# Altium project Power_Clock.PrjPcb
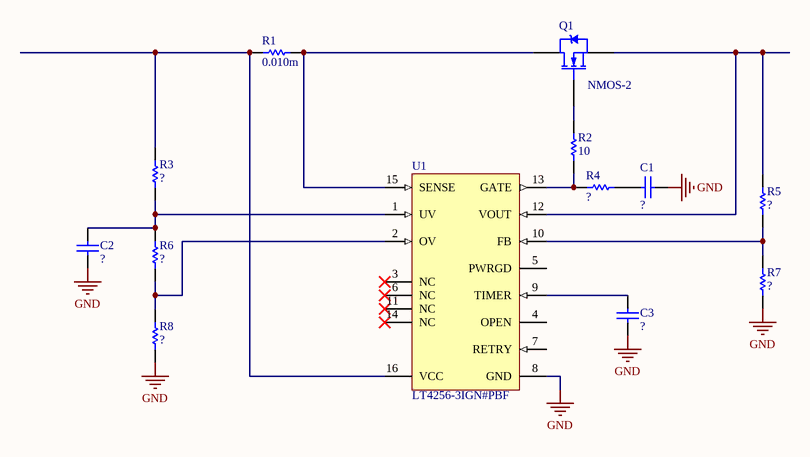
[diagram p0: Sheet1.SchDoc]
3 sheets, 55 parts. Net scope: strictly hierarchical (ports join the sheet entries above them; power ports are local).
Board file: PCB1.PcbDoc
Sheets:
  Sheet1.SchDoc
  Sheet2.SchDoc
  Sheet3.SchDoc

## Sheet Sheet1.SchDoc
size B; Author: E. Sims; Organization: Let's Build Rockets Inc.; SheetNumber: 1; SheetTotal: 3

### Parts
C1  Cap  [RAD-0.3]  (value not drawn)
C2  Cap  [RAD-0.3]  (value not drawn)
C3  Cap  [RAD-0.3]  (value not drawn)
Q1  NMOS-2  [TO-220AB]
R1  value 0.010m  [AXIAL-0.3]  (hidden comment: Res1)
R2  value 10  [AXIAL-0.3]  (hidden comment: Res1)
R3  Res1  [AXIAL-0.3]  (value not drawn)
R4  Res1  [AXIAL-0.3]  (value not drawn)
R5  Res1  [AXIAL-0.3]  (value not drawn)
R6  Res1  [AXIAL-0.3]  (value not drawn)
R7  Res1  [AXIAL-0.3]  (value not drawn)
R8  Res1  [AXIAL-0.3]  (value not drawn)
U1  LT4256-3IGN#PBF  [LT-GN-16_L]

### Nets
GND: C1.1 C2.1 C3.1 R7.1 R8.1 U1.8(GND)
NetC1_2: C1.2 R4.1
NetC2_2: C2.2 R3.1 R6.2 U1.1(UV)
NetC3_2: C3.2 U1.9(TIMER)
NetQ1_1: Q1.1(G) R2.2
NetQ1_2: Q1.2(D) R1.2 U1.15(SENSE)
NetQ1_3: Q1.3(S) R5.2 U1.12(VOUT)
NetR1_1: R1.1 R3.2 U1.16(VCC)
NetR2_1: R2.1 R4.2 U1.13(GATE)
NetR5_1: R5.1 R7.2 U1.10(FB)
NetR6_1: R6.1 R8.2 U1.2(OV)

Not connected (* = marked no-connect by the designer): U1 3(NC)* 4(OPEN) 5(PWRGD) 6(NC)* 7(RETRY) 11(NC)* 14(NC)*

### Notes on the sheet
- Let's Build Rocket's Inc. Modular Paylaod System Based on TMP-010 Rev
  For more information visit https://github.com/LetsBuildRockets/Modular-Payload-System
  This work is licensed under CC BY-NC 4.0. To view a copy of this license, visit https://creativecommons.org/licenses/by-nc/4.0
- Title
- Size:
- Date:
- Assembly Variant:
- B
- Number:
- Time:
- Revision:
- Sheet
- of
- Author:
- File:

### Library data of the parts
C1-C3 = Cap: Capacitor; Published: 8-Jun-2000; LatestRevisionDate: 17-Jul-2002; LatestRevisionNote: Re-released for DXP Platform.; PackageReference: RAD-0.3; Publisher: Altium Limited; PackageDescription: Radial Cap, Thru-Hole; 2 Leads; 0.3 in Pin Spacing; Value: ?
Q1 = NMOS-2: N-Channel Power MOSFET; Note: Pin 2 is electrically connected to pin 4.; Published: 8-Jun-2000; LatestRevisionDate: 17-Jul-2002; LatestRevisionNote: Re-released for DXP Platform.; DatasheetVersion: PD-9.814; PackageVersion: Feb-1997; PackageReference: TO-220AB; Publisher: Altium Limited; PackageDescription: TO, Thru-Hole, Vertical, Heatsink Mounted; 3 In-Line Leads; Pitch 2.54 mm; ComponentLink1Description: Manufacturer Link; ComponentLink1URL: http://www.irf.com/
R1-R8 = Res1: Resistor; Published: 8-Jun-2000; LatestRevisionDate: 17-Jul-2002; LatestRevisionNote: Re-released for DXP Platform.; PackageReference: AXIAL-0.3; Publisher: Altium Limited; PackageDescription: Axial Device, Thru-Hole; 2 Leads; 0.3 in Pin Spacing
  R3-R8: Value: ?
U1 = CMP-0474-00283-1: Positive High Voltage Hot Swap Controller with Open-Circuit Detect, 10.8 to 80 V Vin, 16-pin SOP (GN-16), -40 to 85 degC, Pb-Free; Manufacturer: Linear Technology; Circuit Breaker Threshold: 55 mV; In-Rush Current: Active; Circuit Breaker Accuracy(%): 18; Active Limiting: yes; Fast Comparator: no; Extended Temp: C, I; Circuit Breakers(#): 1; PackageDescription: 16-Pin Plastic SSOP, Body 4.9 x 3.9 mm, Pitch 0.635 mm; DatasheetVersion: Rev. A; PartNumber: LT4256-3IGN#PBF; RoHS: TRUE; PackageVersion: Rev. B, 03/2012; ComponentLink1URL: http://www.linear.com/; Reset: no; ComponentLink2URL: http://cds.linear.com/docs/en/datasheet/42563fa.pm6.pdf; ComponentLink3URL: http://cds.linear.com/docs/en/packaging/05081641_B_GN16.pdf; Fault: no; ComponentLink1Description: Manufacturer URL; Vin Range: 10.8 to 80 V; ComponentLink2Description: Datasheet; PackageReference: GN-16; Power Good: yes; ComponentLink3Description: Package Specification; Mounting Technology: Surface Mount; Foldback: yes

## Sheet Sheet2.SchDoc
size B; Author: E. Sims; Organization: Let's Build Rockets Inc.; SheetNumber: 2; SheetTotal: 3
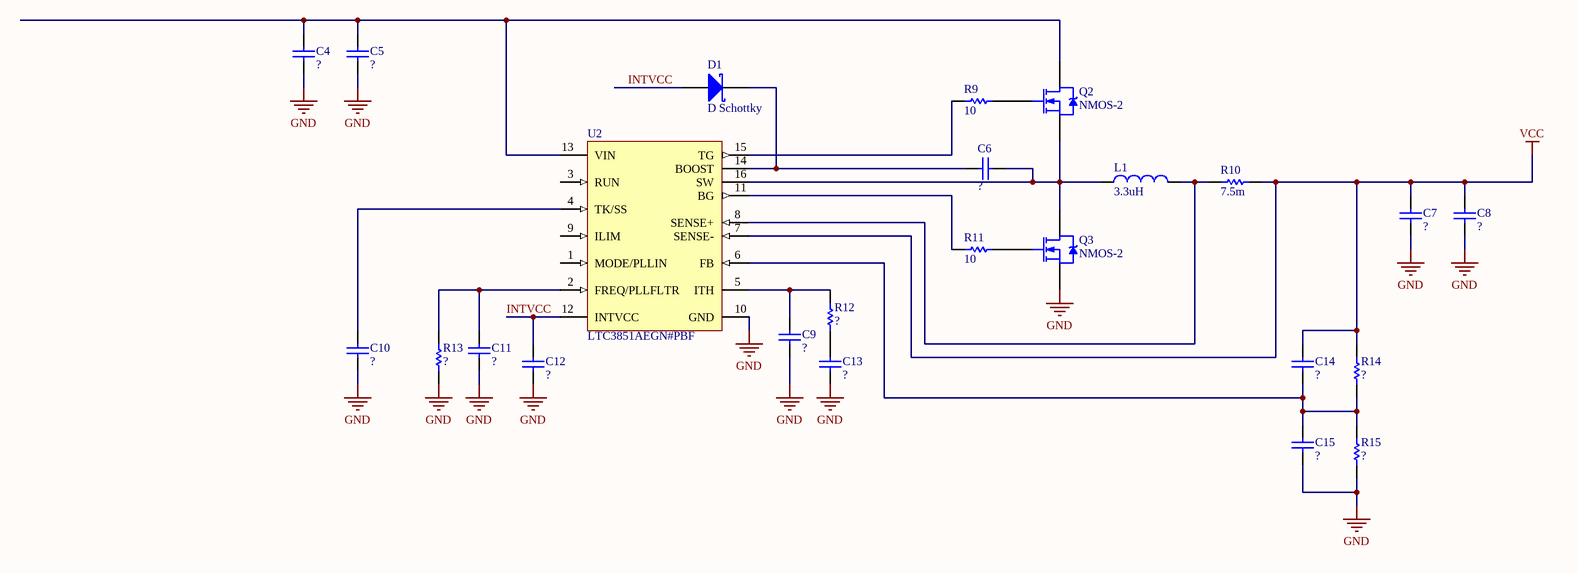
[diagram p1: Sheet2.SchDoc]

### Parts
C4  Cap  [RAD-0.3]  (value not drawn)
C5  Cap  [RAD-0.3]  (value not drawn)
C6  Cap  [RAD-0.3]  (value not drawn)
C7  Cap  [RAD-0.3]  (value not drawn)
C8  Cap  [RAD-0.3]  (value not drawn)
C9  Cap  [RAD-0.3]  (value not drawn)
C10  Cap  [RAD-0.3]  (value not drawn)
C11  Cap  [RAD-0.3]  (value not drawn)
C12  Cap  [RAD-0.3]  (value not drawn)
C13  Cap  [RAD-0.3]  (value not drawn)
C14  Cap  [RAD-0.3]  (value not drawn)
C15  Cap  [RAD-0.3]  (value not drawn)
D1  D Schottky  [SMB]
L1  value 3.3uH  [0402-A]  (hidden comment: Inductor)
Q2  NMOS-2  [TO-220AB]
Q3  NMOS-2  [TO-220AB]
R9  value 10  [AXIAL-0.3]  (hidden comment: Res1)
R10  value 7.5m  [AXIAL-0.3]  (hidden comment: Res1)
R11  value 10  [AXIAL-0.3]  (hidden comment: Res1)
R12  Res1  [AXIAL-0.3]  (value not drawn)
R13  Res1  [AXIAL-0.3]  (value not drawn)
R14  Res1  [AXIAL-0.3]  (value not drawn)
R15  Res1  [AXIAL-0.3]  (value not drawn)
U2  LTC3851AEGN#PBF  [LT-GN-16_L]

### Nets
GND: C4.1 C5.1 C7.1 C8.1 C9.1 C10.1 C11.1 C12.1 C13.1 C15.1 Q3.3(S) R13.1 R15.1 U2.10(GND)
VCC: C7.2 C8.2 C14.2 R10.1 R14.2 U2.7(SENSE-)
INTVCC: C12.2 D1.1(A) U2.12(INTVCC)
NetC4_2: C4.2 C5.2 Q2.2(D) U2.13(VIN)
NetC6_1: C6.1 L1.1 Q2.3(S) Q3.2(D) U2.16(SW)
NetC6_2: C6.2 D1.2(K) U2.14(BOOST)
NetC9_2: C9.2 R12.2 U2.5(ITH)
NetC10_2: C10.2 U2.4(TK/SS)
NetC11_2: C11.2 R13.2 U2.2(FREQ/PLLFLTR)
NetC13_2: C13.2 R12.1
NetC14_1: C14.1 C15.2 R14.1 R15.2 U2.6(FB)
NetL1_2: L1.2 R10.2 U2.8(SENSE+)
NetQ2_1: Q2.1(G) R9.1
NetQ3_1: Q3.1(G) R11.1
NetR9_2: R9.2 U2.15(TG)
NetR11_2: R11.2 U2.11(BG)

Not connected (* = marked no-connect by the designer): U2 1(MODE/PLLIN) 3(RUN) 9(ILIM)

### Notes on the sheet
- Let's Build Rocket's Inc. Modular Paylaod System Based on TMP-010 Rev
  For more information visit https://github.com/LetsBuildRockets/Modular-Payload-System
  This work is licensed under CC BY-NC 4.0. To view a copy of this license, visit https://creativecommons.org/licenses/by-nc/4.0
- Title
- Size:
- Date:
- Assembly Variant:
- B
- Number:
- Time:
- Revision:
- Sheet
- of
- Author:
- File:

### Library data of the parts
C4-C15 = Cap: Capacitor; Published: 8-Jun-2000; LatestRevisionDate: 17-Jul-2002; LatestRevisionNote: Re-released for DXP Platform.; PackageReference: RAD-0.3; Publisher: Altium Limited; PackageDescription: Radial Cap, Thru-Hole; 2 Leads; 0.3 in Pin Spacing; Value: ?
D1 = D Schottky: Schottky Diode; Published: 8-Jun-2000; LatestRevisionDate: 17-Jul-2002; LatestRevisionNote: Re-released for DXP Platform.; PackageReference: SMB; Publisher: Altium Limited; PackageDescription: DO-214-AA/SMB; 2 C-Bend Leads; Body 5.3 x 3.6 mm, inc. leads (LxW); Code_JEDEC: DO-214-AA
L1 = Inductor: Code_IEC: 1005; Published: 8-Jun-2000; LatestRevisionDate: 29-May-2009; LatestRevisionNote: IPC-7351 Footprint Added.; PackageReference: 0402-A; Publisher: Altium Limited; PackageDescription: Chip Inductor; Code_JEITA: 0402
Q2 Q3 = NMOS-2: as Q1 on sheet Sheet1; Published: 8-Jun-2000; LatestRevisionDate: 17-Jul-2002; LatestRevisionNote: Re-released for DXP Platform.; DatasheetVersion: PD-9.814; PackageVersion: Feb-1997; PackageReference: TO-220AB; Publisher: Altium Limited; PackageDescription: TO, Thru-Hole, Vertical, Heatsink Mounted; 3 In-Line Leads; Pitch 2.54 mm; ComponentLink1Description: Manufacturer Link; ComponentLink1URL: http://www.irf.com/
R9-R15 = Res1: Resistor; Published: 8-Jun-2000; LatestRevisionDate: 17-Jul-2002; LatestRevisionNote: Re-released for DXP Platform.; PackageReference: AXIAL-0.3; Publisher: Altium Limited; PackageDescription: Axial Device, Thru-Hole; 2 Leads; 0.3 in Pin Spacing
  R12-R15: Value: ?
U2 = CMP-0492-01020-1: Synchronous Step-Down Switching Regulator Controller (with Improved PLL), 16-pin SOP (GN-16), -40 to 125 degC, Pb-Free; Manufacturer: Linear Technology; Number of Outputs: 1; Frequency Sync Range: 250kHz - 750kHz; ComponentLink3URL: http://cds.linear.com/docs/en/packaging/05081641_B_GN16.pdf; ComponentLink2URL: http://cds.linear.com/docs/en/datasheet/3851afa.pdf; PartNumber: LTC3851AEGN#PBF; Mounting Technology: Surface Mount; PackageDescription: 16-Pin Plastic SSOP, Body 4.9 x 3.9 mm, Pitch 0.635 mm; ComponentLink1URL: http://www.linear.com/; ComponentLink1Description: Manufacturer URL; ComponentLink2Description: Datasheet; RoHS: TRUE; PackageReference: GN-16; DatasheetVersion: Rev. A; PackageVersion: Rev. B, 03/2012; ComponentLink3Description: Package Specification

## Sheet Sheet3.SchDoc
size B; Author: E. Sims; Organization: Let's Build Rockets Inc.; SheetNumber: 4; SheetTotal: 4
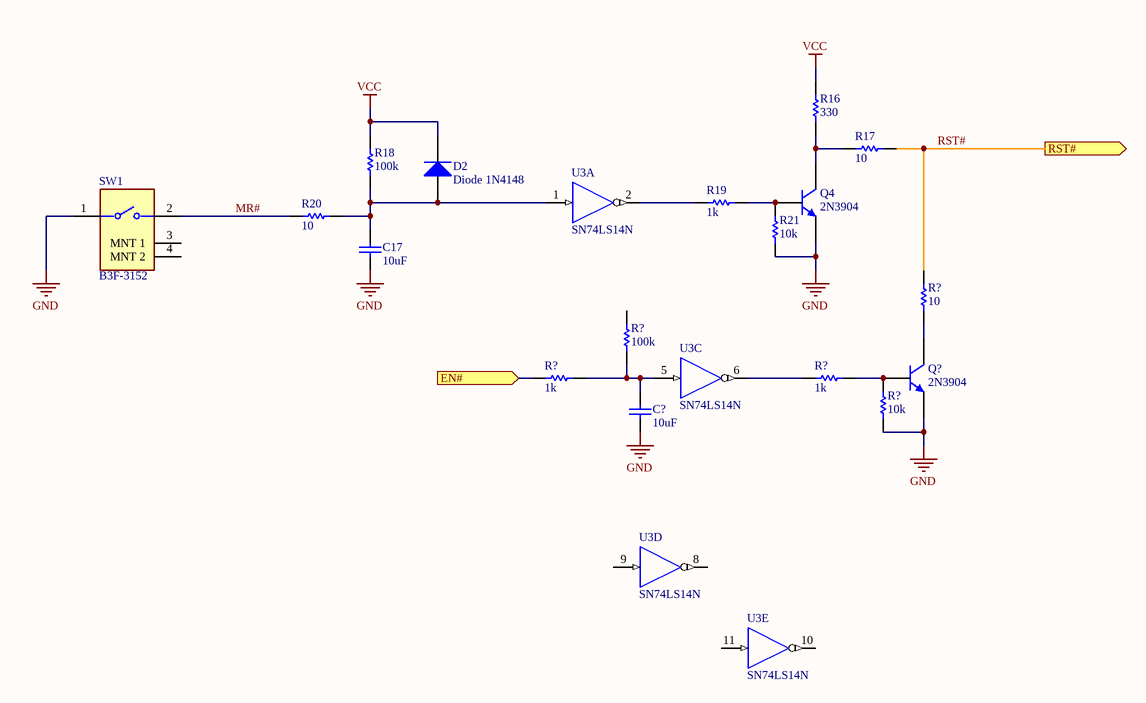
[diagram p2: Sheet3.SchDoc]

### Parts
(Parts that share a designator on the sheet are numbered #1, #2 ... from top to bottom, then left to right.)
C17  value 10uF  [RAD-0.3]  (hidden comment: Cap)
C?  value 10uF  [RAD-0.3]  (hidden comment: Cap)
D2  Diode 1N4148  [DO-35]
Q4  2N3904  [TO-92A]
Q?  2N3904  [TO-92A]
R16  value 330  [AXIAL-0.3]  (hidden comment: Res1)
R17  value 10  [AXIAL-0.3]  (hidden comment: Res1)
R18  value 100k  [AXIAL-0.3]  (hidden comment: Res1)
R19  value 1k  [AXIAL-0.3]  (hidden comment: Res1)
R20  value 10  [AXIAL-0.3]  (hidden comment: Res1)
R21  value 10k  [AXIAL-0.3]  (hidden comment: Res1)
R?#1  value 10  [AXIAL-0.3]  (hidden comment: Res1)
R?#2  value 100k  [AXIAL-0.3]  (hidden comment: Res1)
R?#3  value 1k  [AXIAL-0.3]  (hidden comment: Res1)
R?#4  value 1k  [AXIAL-0.3]  (hidden comment: Res1)
R?#5  value 10k  [AXIAL-0.3]  (hidden comment: Res1)
SW1  B3F-3152  [FP-B3F-3152-MFG]
U3  SN74LS14N  [N014]  (parts A,C,D,E of 6)

### Ports
EN# (in), RST# (out)

### Nets
GND: C17.1 C?.1 Q4.1(E) Q?.1(E) R21.2 R?#5.2 SW1.1 U3.7(GND)
VCC: D2.2(K) R16.1 R18.2 U3.14(VCC)
MR#: R20.2 SW1.2
RST#: R17.1 R?#1.1 ; port RST#
NetC17_2: C17.2 D2.1(A) R18.1 R20.1 U3.1(A)
NetC?_2: C?.2 R?#2.1 R?#3.1 U3.5(A)
NetQ4_2: Q4.2(B) R19.1 R21.1
NetQ4_3: Q4.3(C) R16.2 R17.2
NetQ?_2: Q?.2(B) R?#4.1 R?#5.1
NetQ?_3: Q?.3(C) R?#1.2
NetR19_2: R19.2 U3.2(Y)
NetR?#3_2: R?#3.2 ; port EN#
NetR?#4_2: R?#4.2 U3.6(Y)

Not connected (* = marked no-connect by the designer): R?#2 2; SW1 3(MNT_1) 4(MNT_2); U3 8(Y) 9(A) 10(Y) 11(A)

### Notes on the sheet
- Let's Build Rocket's Inc. Modular Paylaod System Based on TMP-010 Rev
  For more information visit https://github.com/LetsBuildRockets/Modular-Payload-System
  This work is licensed under CC BY-NC 4.0. To view a copy of this license, visit https://creativecommons.org/licenses/by-nc/4.0
- Title
- Size:
- Date:
- Assembly Variant:
- B
- Number:
- Time:
- Revision:
- Sheet
- of
- Author:
- File:

### Library data of the parts
C17 C? = Cap: Capacitor; Published: 8-Jun-2000; LatestRevisionDate: 17-Jul-2002; LatestRevisionNote: Re-released for DXP Platform.; PackageReference: RAD-0.3; Publisher: Altium Limited; PackageDescription: Radial Cap, Thru-Hole; 2 Leads; 0.3 in Pin Spacing
D2 = Diode 1N4148: High Conductance Fast Diode; Published: 8-Jun-2000; LatestRevisionDate: 17-Jul-2002; LatestRevisionNote: Re-released for DXP Platform.; DatasheetVersion: 1997; PackageReference: DO-35; Publisher: Altium Limited; PackageDescription: Diode, Axial; Body 3.8 x 1.9 mm (LxDia. max), Lead Dia. 0.53 mm (max); Code_JEDEC: DO-204-AH; ComponentLink1Description: Manufacturer Link; ComponentLink1URL: http://www.fairchildsemi.com/; ComponentLink2Description: Datasheet; ComponentLink2URL: http://www.fairchildsemi.com/ds/1N%2F1N4148.pdf
Q4 Q? = 2N3904: NPN General Purpose Amplifier; Published: 8-Jun-2000; LatestRevisionDate: 15-Jan-2003; LatestRevisionNote: PCB Footprint 'BCY-W3/D4.7' replaced; DatasheetVersion: 1997; PackageVersion: Sep-1998; PackageReference: TO-92A; Publisher: Altium Limited; PackageDescription: TO, Flat Index; 3 In-Line, Axial Leads; Body Dia. 4.5mm; Leads 0.51 x 0.48 mm (max); ComponentLink1Description: Manufacturer Link; ComponentLink1URL: http://www.fairchildsemi.com/; ComponentLink2Description: Datasheet; ComponentLink2URL: http://www.fairchildsemi.com/ds/2N%2F2N3904.pdf
R16-R21 R?#1-R?#5 = Res1: Resistor; Published: 8-Jun-2000; LatestRevisionDate: 17-Jul-2002; LatestRevisionNote: Re-released for DXP Platform.; PackageReference: AXIAL-0.3; Publisher: Altium Limited; PackageDescription: Axial Device, Thru-Hole; 2 Leads; 0.3 in Pin Spacing
SW1 = CMP-08834-000033-1: SWITCH TACTILE SPST-NO 0.05A 24V; Mechanical Life: 300000Cycles; Max Current Rating: 50mA; Illumination Type: Non-Illuminated; Actuator Color: Yellow; Throw Configuration: SPST; Switch Function: Off-Mom; Ratings: IP00; Switch Travel: 0.25mm; Actuator Type: PLUNGER; Contact Resistance: 100mR; Number of Poles: 1; Operating Force: 1.47N; Height: 6.15mm; Contact Plating: Gold; Contact Type: 1 maker; Termination: PC Pins; Radiation Hardening: No; Contact Material: Gold; Number of Pins: 4; Length: 7.3mm; Width: 6mm; Weight: 0.25g; Packaging: Bulk; Contact Current Rating: 50mA; Max Operating Temperature: 70°C; Lead Free: Lead Free; Mount: Through Hole; RoHS Compliant: Yes; Series: B3F; Orientation: Right Angle; Package Quantity: 1000; Current Rating: 50mA; Max Voltage Rating (DC): 24V; Min Operating Temperature: -25°C; Electrical Life: 300000Cycles; Depth: 7.15mm; Voltage Rating (DC): 24V
U3 = SN74LS14N: Hex Schmitt-Trigger Inverter; Published: 8-Jun-2000; LatestRevisionDate: 04-Mar-2005; LatestRevisionNote: Stylized 3D Model Added.; DatasheetVersion: Mar-1988; PackageVersion: Oct-1995; PackageReference: N014; Publisher: Altium Limited; PackageDescription: DIP; 14 Leads; Row Spacing 7.62 mm; Pitch 2.54 mm; ComponentLink1Description: Manufacturer Link; ComponentLink1URL: http://www.ti.com/; ComponentLink2Description: Datasheet; ComponentLink2URL: http://www-s.ti.com/sc/ds/sn74ls14.pdf